# EasyEDA Pro project pdb.eprj, board dist-12x4
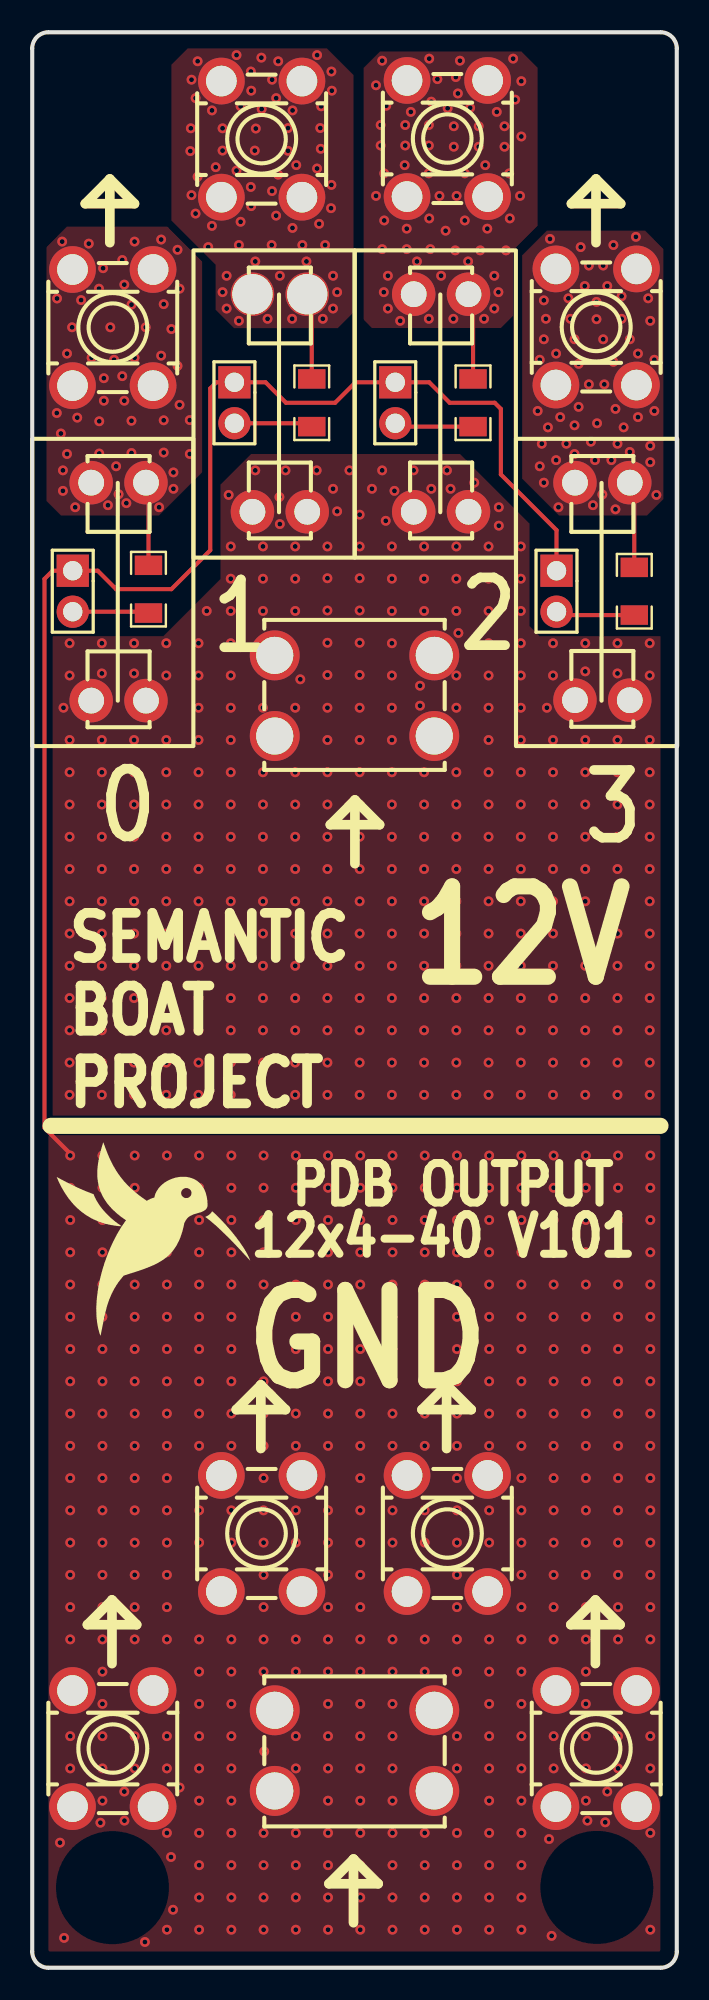
[diagram p5: board, top side]
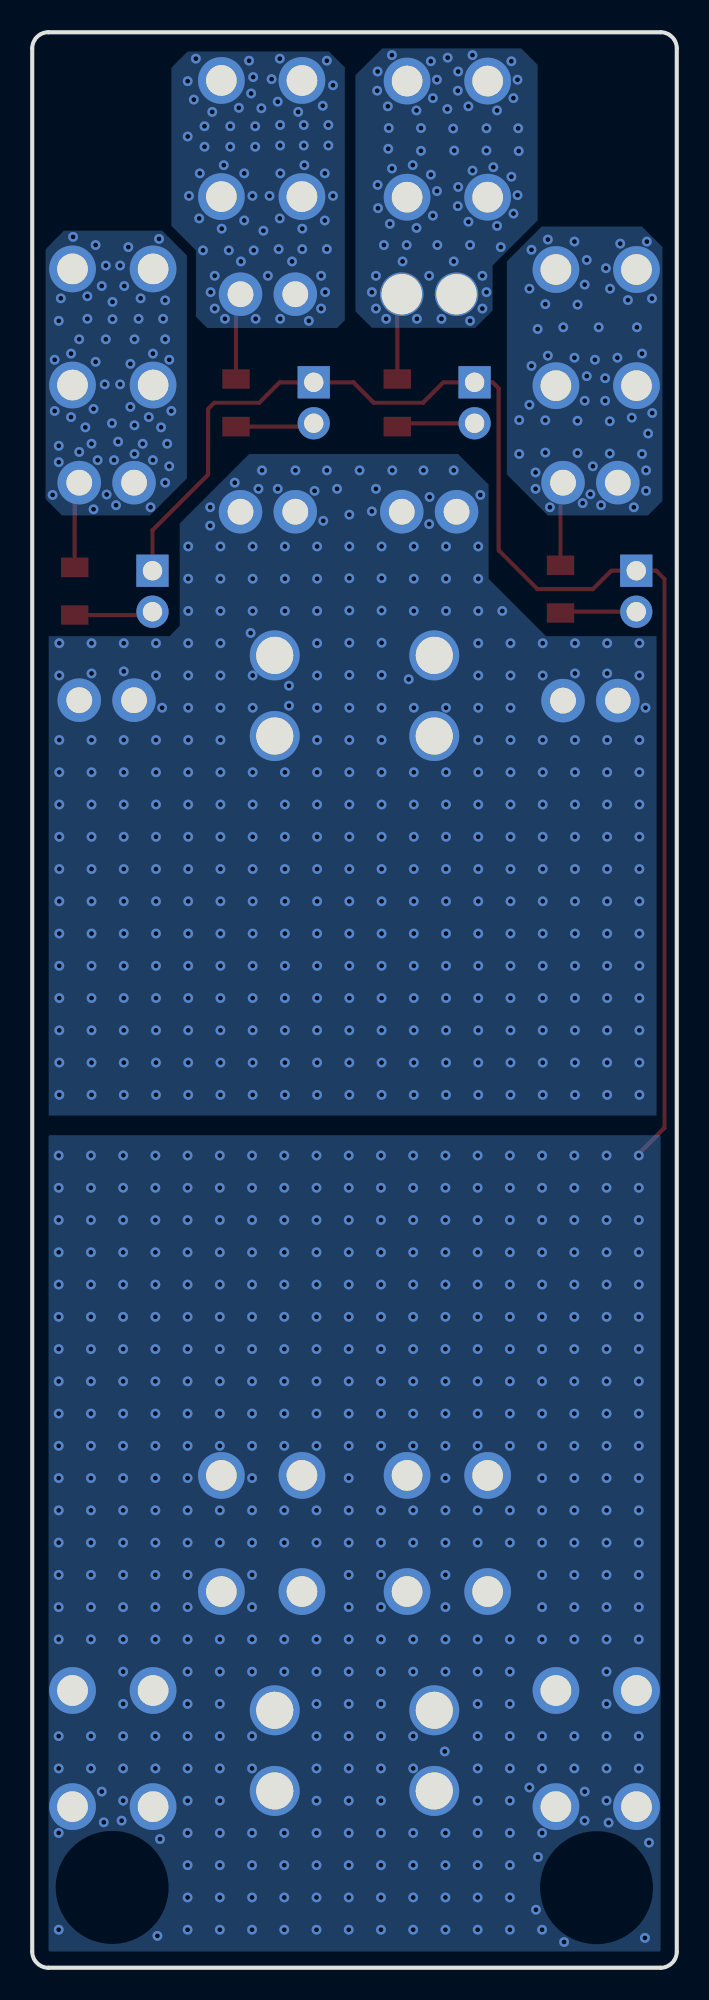
[diagram p6: board, bottom side, seen from below]

Outline 40 x 120 mm; copper layers: Top Layer, Bottom Layer. Coordinates in mm from the lower left corner of the outline.
Outline path: 0,119 0,1 arc(0.29,0.29) 1,0 39,0 arc(39.71,0.29) 40,1 40,119 arc(39.71,119.71) 39,120 1,120 arc(0.29,119.71) 0,119
Stack: Top Layer 0.035mm / Dielectric1 1.51mm FR4 er 4.5 / Bottom Layer 0.035mm

## Design rules (mm)
template: JLCPCB Capability(Two Layers Board)
spacing copperThickness1oz (default): track to track 0.102, other pairs 0.152 to 0.3
spacing copperThickness2oz: track to track 0.203, other pairs 0.152 to 0.3
track width copperThickness1oz (default): min 0.127, default 0.254, max 2.54
track width copperThickness2oz: min 0.203, default 0.254, max 2.54
differential pair differentialPair (default): width min 0.127, default 0.254, max 2.54; gap min 0.152, default 0.152
via viaSize (default): diameter min 0.5, default 0.61, max 10; hole min 0.3, default 0.305, max 6.3

## Placement (name value [footprint] x y rotation side)
FH1  T508  [CONN-TH_T508]  5.36 92.08 180 top
FH2  T508  [CONN-TH_T508#2]  15.37 103.76 180 top
FH3  T508  [CONN-TH_T508]  25.37 103.76 180 top
FH4  T508  [CONN-TH_T508]  35.38 92.08 180 top
FH5  T508  [CONN-TH_T508]  5.36 78.56 0 top
FH6  T508  [CONN-TH_T508]  15.37 90.27 0 top
FH7  T508  [CONN-TH_T508]  25.38 90.27 0 top
FH8  T508  [CONN-TH_T508]  35.38 78.59 0 top
H1  PZ254V-11-02P  [HDR-TH_2P-P2.54-V-M]  2.51 85.34 270 top
H2  PZ254V-11-02P  [HDR-TH_2P-P2.54-V-M]  12.55 97.03 270 top
H3  PZ254V-11-02P  [HDR-TH_2P-P2.54-V-M]  22.53 97.03 270 top
H4  PZ254V-11-02P  [HDR-TH_2P-P2.54-V-M]  32.54 85.34 270 top
R1  10kΩ  [R1206]  7.21 85.47 270 top
R2  10kΩ  [R1206]  17.35 97.03 270 top
R3  10kΩ  [R1206]  27.36 97.03 270 top
R4  10kΩ  [R1206]  37.36 85.34 270 top
U1  60A/M5  [TH_4P-L11.1-W9.2-P5.00]  20 13.46 180 top
U2  60A/M5  [TH_4P-L11.1-W9.2-P5.00]  20 78.87 0 top
U3  T44001  [CONN-TH_T44001]  5 101.69 0 top
U4  T44001  [CONN-TH_T44001]  14.24 113.37 0 top
U5  T44001  [CONN-TH_T44001]  25.76 113.41 180 top
U6  T44001  [CONN-TH_T44001]  35 101.73 180 top
U7  T44001  [CONN-TH_T44001]  14.24 26.92 0 top
U8  T44001  [CONN-TH_T44001]  25.76 26.92 0 top
U9  T44001  [CONN-TH_T44001]  5 13.59 0 top
U10  T44001  [CONN-TH_T44001]  35 13.59 0 top

## Footprints (pads in the part's own frame, mm; a bottom-side part is the same pattern mirrored in y, then rotated)
CONN-TH_T508
  round 2.7 hole 1.6: 1(1.7,0) 2(-1.7,0)
CONN-TH_T508#2
  round 2.7 hole 1.6x2.5: 1(1.7,0) 2(-1.7,0)
CONN-TH_T44001
  round 2.9 hole 1.9: 1(-2.5,3.6) 2(-2.5,-3.6) 3(2.5,-3.6) 4(2.5,3.6)
HDR-TH_2P-P2.54-V-M
  rect 2x2 hole 1.2: 1(-1.27,0)
  round 2 hole 1.2: 2(1.27,0)
R1206
  rect 1.208x1.701 smd: 1(-1.479,0) 2(1.479,0)
TH_4P-L11.1-W9.2-P5.00
  round 3.1 hole 2.3: 1(-4.95,-2.5) 2(-4.95,2.5) 3(4.95,2.5) 4(4.95,-2.5)

## Nets
As in the schematic.

## Via types
v1: diameter 0.61, hole 0.305, Top Layer to Bottom Layer, 974 vias

## Routing (per net, layer and track width the routed paths; a pad name or vN(x,y) marks a point on that pad's centre or on a via; arc(x,y) is an arc through that point)
GND: length 89.7
  Top Layer w0.254: 2.36,50.47 0.76,52.07 0.76,86.11 1.27,86.61 H1.1 4.06,86.61 5.21,85.47 8.64,85.47 11.05,87.88 11.05,97.92 11.43,98.3 H2.1 14.48,98.3 15.75,97.03 18.8,97.03 20.07,98.3 H3.1 24.64,98.3 25.91,97.03 28.7,97.03 29.08,96.65 29.08,92.58 32.54,89.13 H4.1
  vias: v1(1.72,7.75) v1(1.98,1.85) v1(2.36,50.36) v1(2.36,48.36) v1(2.36,46.36) v1(2.36,44.36) v1(2.36,42.36) v1(2.36,40.36) v1(2.36,38.36) v1(2.36,36.36) v1(2.36,34.36) v1(2.36,32.36) v1(2.36,30.36) v1(2.36,28.36) v1(2.36,26.36) v1(2.36,24.36) v1(2.36,22.36) v1(2.36,20.36) v1(2.36,14.36) v1(2.36,12.36) v1(4.23,8.99) v1(4.36,50.36) v1(4.36,48.36) v1(4.36,46.36) v1(4.36,44.36) v1(4.36,42.36) v1(4.36,40.36) v1(4.36,38.36) v1(4.36,36.36) v1(4.36,34.36) v1(4.36,32.36) v1(4.36,30.36) v1(4.36,28.36) v1(4.36,26.36) v1(4.36,24.36) v1(4.36,22.36) v1(4.36,20.36) v1(4.36,18.36) v1(4.36,16.36) v1(4.36,14.36) v1(4.36,12.36) v1(4.36,10.36) v1(5.72,10.92) v1(5.72,9.12) v1(6.36,50.36) v1(6.36,48.36) v1(6.36,46.36) v1(6.36,44.36) v1(6.36,42.36) v1(6.36,40.36) v1(6.36,38.36) v1(6.36,36.36) v1(6.36,34.36) v1(6.36,32.36) v1(6.36,30.36) v1(6.36,28.36) v1(6.36,26.36) v1(6.36,24.36) v1(6.36,22.36) v1(6.36,20.36) v1(6.36,14.36) v1(6.36,12.36) v1(6.99,1.6) v1(8.36,50.36) v1(8.36,48.36) v1(8.36,46.36) v1(8.36,44.36) v1(8.36,42.36) v1(8.36,40.36) v1(8.36,38.36) v1(8.36,36.36) v1(8.36,34.36) v1(8.36,32.36) v1(8.36,30.36) v1(8.36,28.36) v1(8.36,26.36) v1(8.36,24.36) v1(8.36,22.36) v1(8.36,20.36) v1(8.36,14.36) v1(8.36,12.36) v1(8.36,8.36) v1(8.36,2.36) v1(8.61,6.87) v1(8.74,3.6) v1(9.14,11.18) v1(10.36,50.36) v1(10.36,48.36) v1(10.36,46.36) v1(10.36,44.36) v1(10.36,42.36) v1(10.36,40.36) v1(10.36,38.36) v1(10.36,36.36) v1(10.36,34.36) v1(10.36,32.36) v1(10.36,28.36) v1(10.36,26.36) v1(10.36,20.36) v1(10.36,18.36) v1(10.36,16.36) v1(10.36,14.36) v1(10.36,12.36) v1(10.36,10.36) v1(10.36,8.36) v1(10.36,6.36) v1(10.36,4.36) v1(10.36,2.36) v1(12.36,50.36) v1(12.36,48.36) v1(12.36,46.36) v1(12.36,44.36) v1(12.36,42.36) v1(12.36,40.36) v1(12.36,38.36) v1(12.36,36.36) v1(12.36,34.36) v1(12.36,32.36) v1(12.36,28.36) v1(12.36,26.36) v1(12.36,20.36) v1(12.36,18.36) v1(12.36,16.36) v1(12.36,14.36) v1(12.36,12.36) v1(12.36,10.36) v1(12.36,8.36) v1(12.36,6.36) v1(12.36,4.36) v1(12.36,2.36) v1(14.36,50.36) v1(14.36,48.36) v1(14.36,46.36) v1(14.36,44.36) v1(14.36,42.36) v1(14.36,40.36) v1(14.36,38.36) v1(14.36,36.36) v1(14.36,34.36) v1(14.36,32.36) v1(14.36,30.36) v1(14.36,28.36) v1(14.36,26.36) v1(14.36,24.36) v1(14.36,22.36) v1(14.36,20.36) v1(14.36,18.36) v1(14.4,13.41) v1(14.36,8.36) v1(14.36,6.36) v1(14.36,4.36) v1(14.36,2.36) v1(16.36,50.36) v1(16.36,48.36) v1(16.36,46.36) v1(16.36,44.36) v1(16.36,42.36) v1(16.36,40.36) v1(16.36,38.36) v1(16.36,36.36) v1(16.36,34.36) v1(16.36,32.36) v1(16.36,28.36) v1(16.36,26.36) v1(16.36,20.36) v1(16.36,18.36) v1(16.36,14.36) v1(16.36,12.36) v1(16.36,8.36) v1(16.36,6.36) v1(16.36,4.36) v1(16.36,2.36) v1(18.36,50.36) v1(18.36,48.36) v1(18.36,46.36) v1(18.36,44.36) v1(18.36,42.36) v1(18.36,40.36) v1(18.36,38.36) v1(18.36,36.36) v1(18.36,34.36) v1(18.36,32.36) v1(18.36,28.36) v1(18.36,26.36) v1(18.36,24.36) v1(18.36,22.36) v1(18.36,20.36) v1(18.36,18.36) v1(18.36,16.36) v1(18.36,14.36) v1(18.36,12.36) v1(18.36,10.36) v1(18.36,8.36) v1(18.36,6.36) v1(18.36,4.36) v1(18.36,2.36) v1(20.36,50.36) v1(20.36,48.36) v1(20.36,46.36) v1(20.36,44.36) v1(20.36,42.36) v1(20.36,40.36) v1(20.36,38.36) v1(20.36,36.36) v1(20.36,34.36) v1(20.36,32.36) v1(20.36,30.36) v1(20.36,28.36) v1(20.36,26.36) v1(20.36,24.36) v1(20.36,22.36) v1(20.36,20.36) v1(20.36,18.36) v1(20.36,16.36) v1(20.36,14.36) v1(20.36,12.36) v1(20.36,10.36) v1(20.36,8.36) v1(20.36,6.36) v1(20.36,4.36) v1(20.36,2.36) v1(22.36,50.36) v1(22.36,48.36) v1(22.36,46.36) v1(22.36,44.36) v1(22.36,42.36) v1(22.36,40.36) v1(22.36,38.36) v1(22.36,36.36) v1(22.36,34.36) v1(22.36,32.36) v1(22.36,28.36) v1(22.36,26.36) v1(22.36,20.36) v1(22.36,18.36) v1(22.36,16.36) v1(22.36,14.36) v1(22.36,12.36) v1(22.36,10.36) v1(22.36,8.36) v1(22.36,6.36) v1(22.36,4.36) v1(22.36,2.36) v1(24.36,50.36) v1(24.36,48.36) v1(24.36,46.36) v1(24.36,44.36) v1(24.36,42.36) v1(24.36,40.36) v1(24.36,38.36) v1(24.36,36.36) v1(24.36,34.36) v1(24.36,32.36) v1(24.36,28.36) v1(24.36,26.36) v1(24.36,20.36) v1(24.36,18.36) v1(24.36,8.36) v1(24.36,6.36) v1(24.36,4.36) v1(24.36,2.36) v1(26.36,50.36) v1(26.36,48.36) v1(26.36,46.36) v1(26.36,44.36) v1(26.36,42.36) v1(26.36,40.36) v1(26.36,38.36) v1(26.36,36.36) v1(26.36,34.36) v1(26.36,32.36) v1(26.36,30.36) v1(26.36,28.36) v1(26.36,26.36) v1(26.36,24.36) v1(26.36,22.36) v1(26.36,20.36) v1(26.36,18.36) v1(26.36,14.36) v1(26.36,12.36) v1(26.36,8.36) v1(26.36,6.36) v1(26.36,4.36) v1(26.36,2.36) v1(28.36,50.36) v1(28.36,48.36) v1(28.36,46.36) v1(28.36,44.36) v1(28.36,42.36) v1(28.36,40.36) v1(28.36,38.36) v1(28.36,36.36) v1(28.36,34.36) v1(28.36,32.36) v1(28.36,28.36) v1(28.36,26.36) v1(28.36,20.36) v1(28.36,18.36) v1(28.36,16.36) v1(28.36,14.36) v1(28.36,12.36) v1(28.36,10.36) v1(28.36,8.36) v1(28.36,6.36) v1(28.36,4.36) v1(28.36,2.36) v1(30.36,50.36) v1(30.36,48.36) v1(30.36,46.36) v1(30.36,44.36) v1(30.36,42.36) v1(30.36,40.36) v1(30.36,38.36) v1(30.36,36.36) v1(30.36,34.36) v1(30.36,32.36) v1(30.36,30.36) v1(30.36,28.36) v1(30.36,26.36) v1(30.36,24.36) v1(30.36,22.36) v1(30.36,20.36) v1(30.36,18.36) v1(30.36,16.36) v1(30.36,14.36) v1(30.36,12.36) v1(30.36,10.36) v1(30.36,8.36) v1(30.36,6.36) v1(30.36,4.36) v1(30.36,2.36) v1(32.07,7.98) v1(32.23,1.98) v1(32.36,50.36) v1(32.36,48.36) v1(32.36,46.36) v1(32.36,44.36) v1(32.36,42.36) v1(32.36,40.36) v1(32.36,38.36) v1(32.36,36.36) v1(32.36,34.36) v1(32.36,32.36) v1(32.36,30.36) v1(32.36,28.36) v1(32.36,26.36) v1(32.36,24.36) v1(32.36,22.36) v1(32.36,20.36) v1(32.36,14.36) v1(32.36,12.36) v1(34.36,50.36) v1(34.36,48.36) v1(34.36,46.36) v1(34.36,44.36) v1(34.36,42.36) v1(34.36,40.36) v1(34.36,38.36) v1(34.36,36.36) v1(34.36,34.36) v1(34.36,32.36) v1(34.36,30.36) v1(34.36,28.36) v1(34.36,26.36) v1(34.36,24.36) v1(34.36,22.36) v1(34.36,20.36) v1(34.36,18.36) v1(34.36,16.36) v1(34.36,14.36) v1(34.36,12.36) v1(34.36,10.36) v1(34.45,9.12) v1(35.56,9.02) v1(35.69,10.92) v1(36.36,50.36) v1(36.36,48.36) v1(36.36,46.36) v1(36.36,44.36) v1(36.36,42.36) v1(36.36,40.36) v1(36.36,38.36) v1(36.36,36.36) v1(36.36,34.36) v1(36.36,32.36) v1(36.36,30.36) v1(36.36,28.36) v1(36.36,26.36) v1(36.36,24.36) v1(36.36,22.36) v1(36.36,20.36) v1(36.36,14.36) v1(36.36,12.36) v1(38.36,50.36) v1(38.36,48.36) v1(38.36,46.36) v1(38.36,44.36) v1(38.36,42.36) v1(38.36,40.36) v1(38.36,38.36) v1(38.36,36.36) v1(38.36,34.36) v1(38.36,32.36) v1(38.36,30.36) v1(38.36,28.36) v1(38.36,26.36) v1(38.36,24.36) v1(38.36,22.36) v1(38.36,20.36) v1(38.36,14.36) v1(38.36,12.36) v1(38.36,8.36) v1(38.36,2.36)
$1N300:
  vias: v1(1.94,78.12) v1(2.32,82.12) v1(2.32,80.12) v1(2.32,76.12) v1(2.32,74.12) v1(2.32,72.12) v1(2.32,70.12) v1(2.32,68.12) v1(2.32,66.12) v1(2.32,64.12) v1(2.32,62.12) v1(2.32,60.12) v1(2.32,58.12) v1(2.32,56.12) v1(2.32,54.12) v1(4.32,82.12) v1(4.32,80.25) v1(4.32,76.12) v1(4.32,74.12) v1(4.32,72.12) v1(4.32,70.12) v1(4.32,68.12) v1(4.32,66.12) v1(4.32,64.12) v1(4.32,62.12) v1(4.32,60.12) v1(4.32,58.12) v1(4.32,56.12) v1(4.32,54.12) v1(6.32,82.12) v1(6.32,80.25) v1(6.32,76.12) v1(6.32,74.12) v1(6.32,72.12) v1(6.32,70.12) v1(6.32,68.12) v1(6.32,66.12) v1(6.32,64.12) v1(6.32,62.12) v1(6.32,60.12) v1(6.32,58.12) v1(6.32,56.12) v1(6.32,54.12) v1(8.32,82.12) v1(8.32,80.12) v1(8.32,76.12) v1(8.32,74.12) v1(8.32,72.12) v1(8.32,70.12) v1(8.32,68.12) v1(8.32,66.12) v1(8.32,64.12) v1(8.32,62.12) v1(8.32,60.12) v1(8.32,58.12) v1(8.32,56.12) v1(8.32,54.12) v1(10.32,82.12) v1(10.32,80.12) v1(10.32,78.12) v1(10.32,76.12) v1(10.32,74.12) v1(10.32,72.12) v1(10.32,70.12) v1(10.32,68.12) v1(10.32,66.12) v1(10.32,64.12) v1(10.32,62.12) v1(10.32,60.12) v1(10.32,58.12) v1(10.32,56.12) v1(10.32,54.12) v1(10.83,84.12) v1(12.19,91.31) v1(12.32,88.12) v1(12.32,86.12) v1(12.32,84.12) v1(12.32,82.12) v1(12.32,80.12) v1(12.32,78.12) v1(12.32,76.12) v1(12.32,74.12) v1(12.32,72.12) v1(12.32,70.12) v1(12.32,68.12) v1(12.32,66.12) v1(12.32,64.12) v1(12.32,62.12) v1(12.32,60.12) v1(12.32,58.12) v1(12.32,56.12) v1(12.32,54.12) v1(13.84,92.84) v1(14.32,88.12) v1(14.32,86.12) v1(14.32,84.12) v1(14.32,78.12) v1(14.32,74.12) v1(14.32,72.12) v1(14.32,70.12) v1(14.32,68.12) v1(14.32,66.12) v1(14.32,64.12) v1(14.32,62.12) v1(14.32,60.12) v1(14.32,58.12) v1(14.32,56.12) v1(14.32,54.12) v1(15.34,91.19) v1(15.37,89.51) v1(15.72,92.84) v1(16.32,88.12) v1(16.32,86.12) v1(16.32,84.12) v1(16.32,78.12) v1(16.32,74.12) v1(16.32,72.12) v1(16.32,70.12) v1(16.32,68.12) v1(16.32,66.12) v1(16.32,64.12) v1(16.32,62.12) v1(16.32,60.12) v1(16.32,58.12) v1(16.32,56.12) v1(16.32,54.12) v1(16.64,79.88) v1(17.65,92.84) v1(18.32,88.12) v1(18.32,86.15) v1(18.32,84.15) v1(18.32,82.15) v1(18.32,80.15) v1(18.32,78.12) v1(18.32,76.12) v1(18.32,74.12) v1(18.32,72.12) v1(18.32,70.12) v1(18.32,68.12) v1(18.32,66.12) v1(18.32,64.12) v1(18.32,62.12) v1(18.32,60.12) v1(18.32,58.12) v1(18.32,56.12) v1(18.32,54.12) v1(18.67,91.69) v1(18.92,90.3) v1(19.69,92.84) v1(20.32,90.09) v1(20.32,88.12) v1(20.32,86.15) v1(20.32,84.15) v1(20.32,82.15) v1(20.32,80.15) v1(20.32,78.12) v1(20.32,76.12) v1(20.32,74.12) v1(20.32,72.12) v1(20.32,70.12) v1(20.32,68.12) v1(20.32,66.12) v1(20.32,64.12) v1(20.32,62.12) v1(20.32,60.12) v1(20.32,58.12) v1(20.32,56.12) v1(20.32,54.12) v1(21.08,91.69) v1(21.72,92.84) v1(21.94,89.71) v1(22.32,88.12) v1(22.32,86.12) v1(22.32,84.12) v1(22.32,82.12) v1(22.32,80.12) v1(22.32,78.12) v1(22.32,76.12) v1(22.32,74.12) v1(22.32,72.12) v1(22.32,70.12) v1(22.32,68.12) v1(22.32,66.12) v1(22.32,64.12) v1(22.32,62.12) v1(22.32,60.12) v1(22.32,58.12) v1(22.32,56.12) v1(22.32,54.12) v1(22.48,91.57) v1(23.66,92.84) v1(24.07,79.48) v1(24.07,78.25) v1(24.32,88.12) v1(24.32,86.12) v1(24.32,84.12) v1(24.32,74.12) v1(24.32,72.12) v1(24.32,70.12) v1(24.32,68.12) v1(24.32,66.12) v1(24.32,64.12) v1(24.32,62.12) v1(24.32,60.12) v1(24.32,58.12) v1(24.32,56.12) v1(24.32,54.12) v1(24.76,91.69) v1(25.74,92.84) v1(25.96,91.69) v1(26.32,88.12) v1(26.32,86.12) v1(26.32,84.12) v1(26.32,80.12) v1(26.32,78.12) v1(26.32,74.12) v1(26.32,72.12) v1(26.32,70.12) v1(26.32,68.12) v1(26.32,66.12) v1(26.32,64.12) v1(26.32,62.12) v1(26.32,60.12) v1(26.32,58.12) v1(26.32,56.12) v1(26.32,54.12) v1(26.45,82.75) v1(27.43,92.08) v1(28.32,88.12) v1(28.32,86.12) v1(28.32,84.12) v1(28.32,82.12) v1(28.32,80.12) v1(28.32,78.12) v1(28.32,76.12) v1(28.32,74.12) v1(28.32,72.12) v1(28.32,70.12) v1(28.32,68.12) v1(28.32,66.12) v1(28.32,64.12) v1(28.32,62.12) v1(28.32,60.12) v1(28.32,58.12) v1(28.32,56.12) v1(28.32,54.12) v1(28.96,90.55) v1(28.96,89.41) v1(30.32,88.12) v1(30.32,86.12) v1(30.32,84.12) v1(30.32,82.12) v1(30.32,80.12) v1(30.32,78.12) v1(30.32,76.12) v1(30.32,74.12) v1(30.32,72.12) v1(30.32,70.12) v1(30.32,68.12) v1(30.32,66.12) v1(30.32,64.12) v1(30.32,62.12) v1(30.32,60.12) v1(30.32,58.12) v1(30.32,56.12) v1(30.32,54.12) v1(31.94,78.12) v1(32.32,82.12) v1(32.32,80.12) v1(32.32,76.12) v1(32.32,74.12) v1(32.32,72.12) v1(32.32,70.12) v1(32.32,68.12) v1(32.32,66.12) v1(32.32,64.12) v1(32.32,62.12) v1(32.32,60.12) v1(32.32,58.12) v1(32.32,56.12) v1(32.32,54.12) v1(34.32,82.12) v1(34.32,80.37) v1(34.32,76.12) v1(34.32,74.12) v1(34.32,72.12) v1(34.32,70.12) v1(34.32,68.12) v1(34.32,66.12) v1(34.32,64.12) v1(34.32,62.12) v1(34.32,60.12) v1(34.32,58.12) v1(34.32,56.12) v1(34.32,54.12) v1(36.32,82.12) v1(36.32,80.25) v1(36.32,76.12) v1(36.32,74.12) v1(36.32,72.12) v1(36.32,70.12) v1(36.32,68.12) v1(36.32,66.12) v1(36.32,64.12) v1(36.32,62.12) v1(36.32,60.12) v1(36.32,58.12) v1(36.32,56.12) v1(36.32,54.12) v1(38.32,82.12) v1(38.32,80.12) v1(38.32,76.12) v1(38.32,74.12) v1(38.32,72.12) v1(38.32,70.12) v1(38.32,68.12) v1(38.32,66.12) v1(38.32,64.12) v1(38.32,62.12) v1(38.32,60.12) v1(38.32,58.12) v1(38.32,56.12) v1(38.32,54.12)
$1N955: length 5.2
  Top Layer w0.254: FH1.2 7.21,91.92 R1.1
  vias: v1(1.54,103.49) v1(1.52,96.39) v1(1.78,95.12) v1(1.86,107.02) v1(1.91,92.84) v1(1.91,91.57) v1(2.16,100.08) v1(2.16,93.85) v1(2.47,101.71) v1(2.67,90.55) v1(2.79,96.11) v1(3.03,103.4) v1(3.51,106.9) v1(3.68,99.82) v1(4.14,104.1) v1(4.16,95.88) v1(4.16,93.88) v1(4.4,105.37) v1(4.44,98.55) v1(4.44,97.16) v1(4.7,90.68) v1(4.85,101.71) v1(5.08,99.69) v1(5.21,93.09) v1(5.36,91.36) v1(5.59,105.88) v1(5.59,98.68) v1(5.72,104.36) v1(5.72,97.16) v1(5.84,90.81) v1(6.16,103.11) v1(6.16,95.91) v1(6.16,93.91) v1(6.35,107.02) v1(6.35,99.82) v1(7.04,101.71) v1(7.87,90.55) v1(8,107.15) v1(8,99.95) v1(8.16,103.14) v1(8.16,95.94) v1(8.16,93.94) v1(8.64,101.6) v1(8.76,92.71) v1(8.76,91.69) v1(9.02,106.51) v1(9.02,99.31) v1(9.14,104.1) v1(9.14,96.9) v1(9.78,95.95) v1(9.78,93.85)
$1N1606: length 4.7
  Top Layer w0.254: H1.2 7.13,84.07 R1.2
$1N9347: length 5.4
  Top Layer w0.254: R2.1 17.35,103.48 17.07,103.76
  vias: v1(9.84,114.05) v1(9.81,112.63) v1(9.88,117.06) v1(9.88,109.9) v1(10.14,115.92) v1(10.14,108.76) v1(10.27,118.2) v1(10.26,111.04) v1(10.92,106.68) v1(11.15,115.15) v1(11.15,108) v1(11.39,111.64) v1(11.81,114.05) v1(11.81,112.66) v1(11.81,103.89) v1(12.06,104.9) v1(12.06,102.87) v1(12.68,118.58) v1(12.68,111.42) v1(12.83,106.81) v1(12.83,102.11) v1(12.93,115.41) v1(12.93,108.25) v1(13.57,117.57) v1(13.59,116.38) v1(13.56,110.41) v1(13.59,109.22) v1(13.81,112.66) v1(13.84,105.79) v1(13.88,114.03) v1(14.22,118.43) v1(14.24,115.24) v1(14.6,102.23) v1(14.88,117.06) v1(14.88,110.16) v1(14.86,106.81) v1(15.14,115.92) v1(15.14,108.63) v1(15.27,118.2) v1(15.26,111.17) v1(15.37,104.9) v1(15.88,114.06) v1(15.88,112.65) v1(16.13,102.23) v1(16.15,115.15) v1(16.15,107.87) v1(16.39,111.76) v1(16.76,106.81) v1(17.02,105.79) v1(17.68,118.58) v1(17.68,111.55) v1(17.8,108.12) v1(17.93,115.41) v1(17.88,114.06) v1(17.91,112.78) v1(18.03,102.23) v1(18.18,106.81) v1(18.54,109.09) v1(18.57,117.57) v1(18.59,116.38) v1(18.56,110.54) v1(18.67,104.9) v1(18.67,102.87) v1(18.92,103.89)
$1N9352: length 4.9
  Top Layer w0.254: H2.2 17.14,95.76 R2.2
$1N9551: length 5.4
  Top Layer w0.254: FH3.2 27.36,103.48 R3.1
  vias: v1(21.34,116.71) v1(21.34,109.85) v1(21.62,114.25) v1(21.62,112.98) v1(21.72,118.24) v1(21.72,106.55) v1(21.84,111.25) v1(21.84,108.33) v1(21.82,103.89) v1(21.97,115.44) v1(22.07,104.9) v1(22.07,102.87) v1(22.83,102.11) v1(23.15,114.25) v1(23.15,112.98) v1(23.11,111.76) v1(23.24,107.82) v1(23.24,106.55) v1(23.5,115.06) v1(23.88,105.79) v1(24.64,118.36) v1(24.62,114.25) v1(24.62,112.98) v1(24.6,111.25) v1(24.64,108.46) v1(24.61,102.23) v1(24.71,106.55) v1(24.76,115.7) v1(25.15,117.09) v1(25.27,109.85) v1(25.37,104.9) v1(25.65,107.7) v1(25.78,115.29) v1(26.14,102.23) v1(26.16,114.17) v1(26.16,112.9) v1(26.29,117.22) v1(26.34,109.85) v1(26.26,106.48) v1(26.42,116.2) v1(26.54,118.24) v1(26.84,111.25) v1(26.84,108.33) v1(27.05,105.79) v1(27.18,115.32) v1(27.71,114.17) v1(27.71,112.9) v1(27.8,106.48) v1(28.04,102.23) v1(28.11,111.76) v1(28.24,107.82) v1(28.68,104.9) v1(28.68,102.87) v1(28.83,115.06) v1(28.93,103.89) v1(29.31,114.17) v1(29.31,112.9) v1(29.4,106.48) v1(29.6,111.25) v1(29.64,108.46) v1(29.84,118.36) v1(29.97,115.82) v1(30.27,109.85) v1(30.35,116.97) v1(30.35,113.54)
$1N9563: length 4.9
  Top Layer w0.254: R3.2 22.74,95.55 H3.2
$1N9759: length 5.4
  Top Layer w0.254: R4.1 37.36,91.79 FH4.2
  vias: v1(31.37,96.52) v1(31.5,99.69) v1(31.5,93.09) v1(31.62,94.49) v1(31.75,103.38) v1(31.75,100.97) v1(31.75,92.08) v1(31.88,102.23) v1(32,95.5) v1(32.13,107.19) v1(32.51,100.08) v1(32.51,93.47) v1(32.66,90.55) v1(32.77,96.14) v1(33.15,94.49) v1(33.27,103.5) v1(33.4,102.23) v1(33.66,100.97) v1(33.66,95.63) v1(33.66,93.85) v1(33.91,99.44) v1(33.91,96.77) v1(34.04,106.68) v1(34.29,104.27) v1(34.54,105.54) v1(34.54,98.17) v1(34.67,94.61) v1(34.8,90.68) v1(34.93,93.47) v1(35.02,103.28) v1(35.02,102.21) v1(35.05,95.76) v1(35.43,105.54) v1(35.43,100.97) v1(35.38,91.34) v1(35.5,98.17) v1(35.69,104.27) v1(35.94,93.47) v1(36.07,106.81) v1(36.07,99.57) v1(36.19,96.65) v1(36.19,90.42) v1(36.32,94.49) v1(36.58,103.63) v1(36.58,102.23) v1(36.7,95.5) v1(37.09,100.97) v1(37.08,93.98) v1(37.47,107.31) v1(37.59,100.08) v1(37.59,96.14) v1(38.23,103.5) v1(38.35,102.11) v1(38.35,94.36) v1(38.35,93.34) v1(38.61,99.69) v1(38.61,96.52) v1(38.74,91.31)
$1N9771: length 4.9
  Top Layer w0.254: R4.2 32.75,83.86 H4.2

## Copper pours and planes (outline as drawn; the poured copper is in the pictures)
GND on Top Layer: -2.16,52.2 43.18,52.2 43.18,-1.4 -2.16,-1.4
GND on Bottom Layer: -1.02,52.2 41.02,52.2 41.02,-1.14 -1.02,-1.14
$1N300 on Top Layer: 1.27,93.85 38.99,93.85 38.99,52.83 1.27,52.83
$1N300 on Bottom Layer: 1.26,93.85 38.98,93.85 38.98,52.83 1.26,52.83
$1N955 on Top Layer: 0.89,107.95 10.54,107.95 10.54,90.04 0.89,90.04
$1N955 on Bottom Layer: 0.89,107.95 10.54,107.95 10.54,90.04 0.89,90.04
$1N9347 on Top Layer: 8.64,119 19.94,119 19.94,101.65 8.64,101.65
$1N9347 on Bottom Layer: 8.64,119 19.94,119 19.94,101.68 8.64,101.68
$1N9551 on Top Layer: 20.57,118.81 31.37,118.81 31.37,101.66 20.57,101.66
$1N9551 on Bottom Layer: 20.6,118.81 31.37,118.81 31.37,101.66 20.6,101.66
$1N9759 on Top Layer: 30.4,107.7 39.17,107.7 39.17,90.04 30.4,90.04
$1N9759 on Bottom Layer: 30.4,107.7 39.17,107.7 39.17,90.04 30.4,90.04

## Text on the board
Top Silkscreen Layer: 12x4-40 V101 | PDB OUTPUT | SEMANTIC / BOAT / PROJECT | 0 | 1 | 2 | 3 | 12V | GND
